# Altium schematic sheet POWER_RAIL_MONITORING.SchDoc
size B
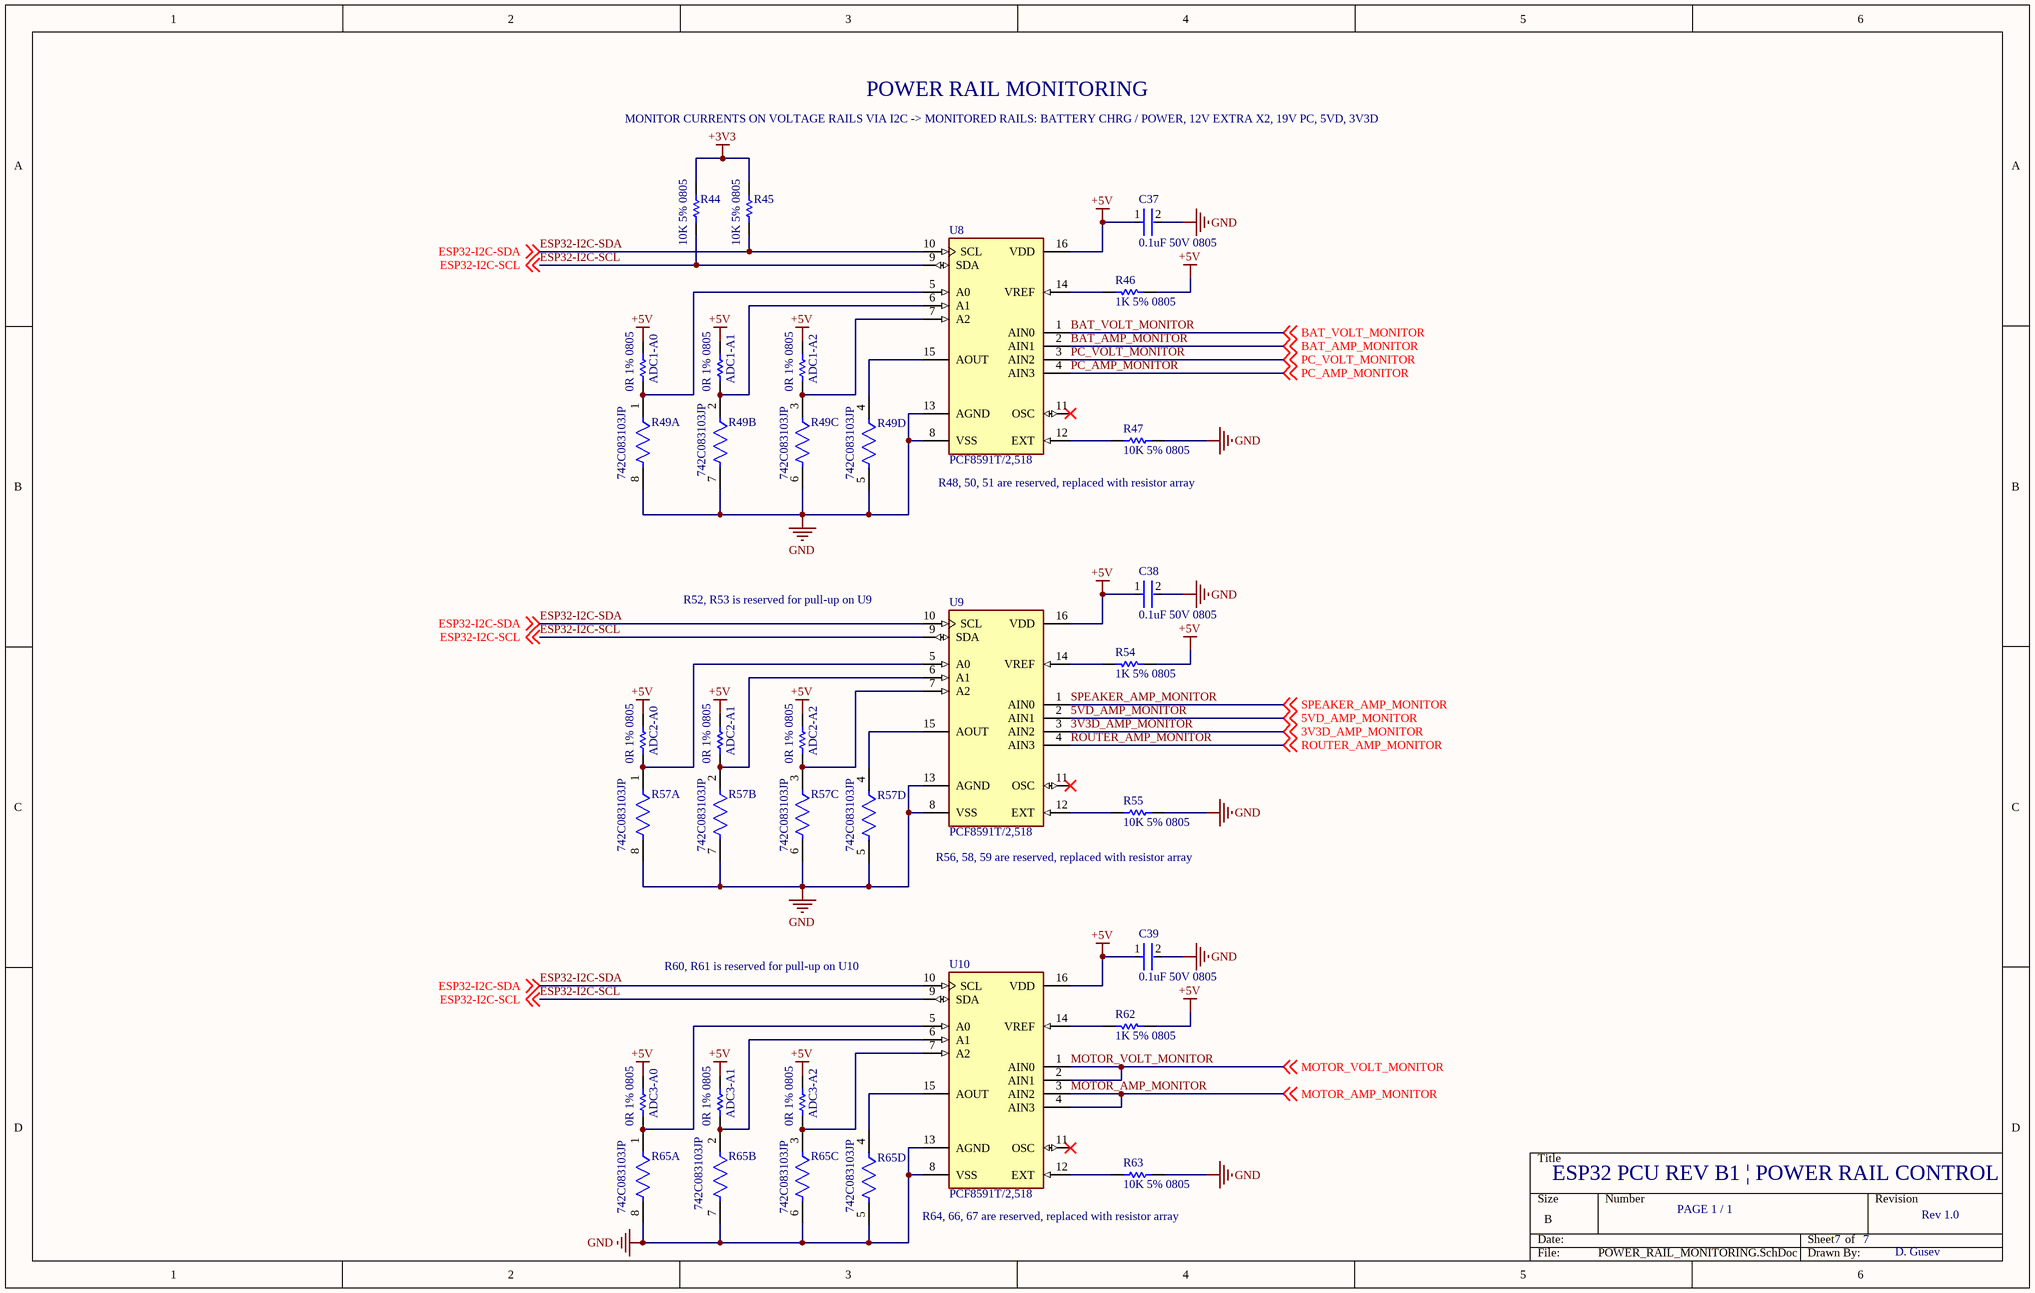
[diagram p0: POWER_RAIL_MONITORING.SchDoc]

## Parts
ADC1-A0  0R 1% 0805  [RESC2013X60X35LL10T20]
ADC1-A1  0R 1% 0805  [RESC2013X60X35LL10T20]
ADC1-A2  0R 1% 0805  [RESC2013X60X35LL10T20]
ADC2-A0  0R 1% 0805  [RESC2013X60X35LL10T20]
ADC2-A1  0R 1% 0805  [RESC2013X60X35LL10T20]
ADC2-A2  0R 1% 0805  [RESC2013X60X35LL10T20]
ADC3-A0  0R 1% 0805  [RESC2013X60X35LL10T20]
ADC3-A1  0R 1% 0805  [RESC2013X60X35LL10T20]
ADC3-A2  0R 1% 0805  [RESC2013X60X35LL10T20]
C37  0.1uF 50V 0805  [FP-C0805C-DN-MFG]
C38  0.1uF 50V 0805  [FP-C0805C-DN-MFG]
C39  0.1uF 50V 0805  [FP-C0805C-DN-MFG]
R44  10K 5% 0805  [RESC2013X60X40ML20T25]
R45  10K 5% 0805  [RESC2013X60X40ML20T25]
R46  1K 5% 0805  [RESC2013X60X40ML20T25]
R47  10K 5% 0805  [RESC2013X60X40ML20T25]
R49  742C083103JP  [FP-742C083-MFG]  (parts A,B,C,D of 4)
R54  1K 5% 0805  [RESC2013X60X40ML20T25]
R55  10K 5% 0805  [RESC2013X60X40ML20T25]
R57  742C083103JP  [FP-742C083-MFG]  (parts A,B,C,D of 4)
R62  1K 5% 0805  [RESC2013X60X40ML20T25]
R63  10K 5% 0805  [RESC2013X60X40ML20T25]
R65  742C083103JP  [FP-742C083-MFG]  (parts A,B,C,D of 4)
U8  PCF8591T/2,518  [FP-SOT162-1-MFG]
U9  PCF8591T/2,518  [FP-SOT162-1-MFG]
U10  PCF8591T/2,518  [FP-SOT162-1-MFG]

## Nets
+3V3: R44.2 R45.2
+5V: ADC1-A0.1 ADC1-A1.1 ADC1-A2.1 ADC2-A0.1 ADC2-A1.1 ADC2-A2.1 ADC3-A0.1 ADC3-A1.1 ADC3-A2.1 C37.1 C38.1 C39.1 R46.2 R54.2 R62.2 U8.16(VDD) U9.16(VDD) U10.16(VDD)
GND: C37.2 C38.2 C39.2 R47.2 R49.5 R49.6 R49.7 R49.8 R55.2 R57.5 R57.6 R57.7 R57.8 R63.2 R65.5 R65.6 R65.7 R65.8 U8.8(VSS) U8.13(AGND) U9.8(VSS) U9.13(AGND) U10.8(VSS) U10.13(AGND)
3V3D_AMP_MONITOR: U9.3(AIN2) ; off-sheet 3V3D_AMP_MONITOR
5VD_AMP_MONITOR: U9.2(AIN1) ; off-sheet 5VD_AMP_MONITOR
BAT_AMP_MONITOR: U8.2(AIN1) ; off-sheet BAT_AMP_MONITOR
BAT_VOLT_MONITOR: U8.1(AIN0) ; off-sheet BAT_VOLT_MONITOR
ESP32-I2C-SCL: R44.1 U8.9(SDA) U9.9(SDA) U10.9(SDA) ; off-sheet ESP32-I2C-SCL
ESP32-I2C-SDA: R45.1 U8.10(SCL) U9.10(SCL) U10.10(SCL) ; off-sheet ESP32-I2C-SDA
MOTOR_AMP_MONITOR: U10.3(AIN2) U10.4(AIN3) ; off-sheet MOTOR_AMP_MONITOR
MOTOR_VOLT_MONITOR: U10.1(AIN0) U10.2(AIN1) ; off-sheet MOTOR_VOLT_MONITOR
PC_AMP_MONITOR: U8.4(AIN3) ; off-sheet PC_AMP_MONITOR
PC_VOLT_MONITOR: U8.3(AIN2) ; off-sheet PC_VOLT_MONITOR
ROUTER_AMP_MONITOR: U9.4(AIN3) ; off-sheet ROUTER_AMP_MONITOR
SPEAKER_AMP_MONITOR: U9.1(AIN0) ; off-sheet SPEAKER_AMP_MONITOR
NetADC1-A0_2: ADC1-A0.2 R49.1 U8.5(A0)
NetADC1-A1_2: ADC1-A1.2 R49.2 U8.6(A1)
NetADC1-A2_2: ADC1-A2.2 R49.3 U8.7(A2)
NetADC2-A0_2: ADC2-A0.2 R57.1 U9.5(A0)
NetADC2-A1_2: ADC2-A1.2 R57.2 U9.6(A1)
NetADC2-A2_2: ADC2-A2.2 R57.3 U9.7(A2)
NetADC3-A0_2: ADC3-A0.2 R65.1 U10.5(A0)
NetADC3-A1_2: ADC3-A1.2 R65.2 U10.6(A1)
NetADC3-A2_2: ADC3-A2.2 R65.3 U10.7(A2)
NetR46_1: R46.1 U8.14(VREF)
NetR47_1: R47.1 U8.12(EXT)
NetR49_4: R49.4 U8.15(AOUT)
NetR54_1: R54.1 U9.14(VREF)
NetR55_1: R55.1 U9.12(EXT)
NetR57_4: R57.4 U9.15(AOUT)
NetR62_1: R62.1 U10.14(VREF)
NetR63_1: R63.1 U10.12(EXT)
NetR65_4: R65.4 U10.15(AOUT)

Not connected (* = marked no-connect by the designer): U8 11(OSC)*; U9 11(OSC)*; U10 11(OSC)*

## Notes on the sheet
- POWER RAIL MONITORING
- MONITOR CURRENTS ON VOLTAGE RAILS VIA I2C -> MONITORED RAILS: BATTERY CHRG / POWER, 12V EXTRA X2, 19V PC, 5VD, 3V3D
- R48, 50, 51 are reserved, replaced with resistor array
- (near U9) R52, R53 is reserved for pull-up on U9
- R56, 58, 59 are reserved, replaced with resistor array
- (near U10) R60, R61 is reserved for pull-up on U10
- R64, 66, 67 are reserved, replaced with resistor array
- ESP32 PCU REV B1 | POWER RAIL CONTROL
- PAGE 1 / 1
- 7
- Rev 1.0
- D. Gusev

## Library data of the parts
ADC1-A0-ADC1-A2 ADC2-A0-ADC2-A2 ADC3-A0-ADC3-A2 = CMP-1659-00014-4: Chip Resistor, 1 Ohm, +/- 1%, 125 mW, -55 to 155 degC, 0805 (2012 Metric), RoHS, Tape and Reel; Manufacturer: Yageo; Voltage Rating: 150 V; REACH SVHC: No SVHC; Mounting Technology: Surface Mount; RoHSCompliant: true; Packaging: Tape and Reel; ComponentLink2URL: http://www.yageo.com/documents/recent/PYu-RC_Group_51_RoHS_L_04.pdf; Pins: 2; Package Quantity: 5000; DatasheetVersion: Rev. 4, 02/2016; Mount: Surface Mount; Max Operating Temperature: 155 degC; PackageDescription: 2-Pin Surface Mounted Device, Body 2 x 1.25 mm; PackageReference: 0805; Length: 2 mm; Min Operating Temperature: -55 degC; ComponentLink1URL: http://www.yageo.com/; Height: 0.5 mm; ComponentLink1Description: Manufacturer URL; ComponentLink2Description: Datasheet
C37-C39 = CMP-2007-00279-2: CAP CER 0.1UF 50V X7R 0805; Manufacturer Part Number: C0805C104K5RACTU; Manufacturer: KEMET; Value: 0.10 μF; Tolerance: 0.1; Temperature Coefficient: 30ppm/°C; Material: Ceramic; Device Class L2: Capacitors; Temperature Range Low: -55°C; Voltage Rating: 50 V; Digikey Description: CAP CER 0.1UF 50V X7R 0805; Category: Cap; ComponentLink2Description: Datasheet; Octopart: https://octopart.com/c0805c104k5ractu-kemet-143926; RoHS: TRUE; ComponentLink2URL: https://content.kemet.com/datasheets/KEM_C1003_C0G_SMD.pdf; Temperature Characteristic: X7R; Temperature: -55°C to +125°C; Height: 0.88mm; Temperature Range High: +125°C; Device Class L1: Passive Components; Automotive: No; Lead Free: Yes; Ipc Land Pattern Name: CAPC200125X78; Device Class L3: Ceramic Capacitors; Mouser Description: Cap Ceramic 0.1uF 50V X7R 10% SMD 2.0 x 1.2 mm 125 C Paper T/R; Capacitance: 0.10 μF; Package: C0805C-DN
R44-R47 R54 R55 R62 R63 = CMP-2001-00590-1: Part Number: ERA6AEB123V; Manufacturer: Panasonic
R49 R57 R65 = CMP-06828-000005-1: RES ARRAY 4 RES 10K OHM 1206; Number of Elements: 4; Circuit Type: Isolated; Power Rating: 250mW; Working Voltage: 50V; Temperature Coefficient: 200ppm/°C; Tolerance: 5%; Resistance: 10kR; Power Per Element: 62.5mW; Power Dissipation: 63mW; Min Operating Temperature: -55°C; Height: 0.028inch; Number of Terminals: 8; Width: 0.063inch; Depth: 1.6mm; Max Operating Temperature: 125°C; Termination: Concave; Lead Free: Lead Free; Mount: Surface Mount; Package Quantity: 1; Military Standard: Not; Radiation Hardening: No; Contact Plating: Tin; Case Code (Metric): 3216; Terminal Pitch: 0.8mm; Number of Pins: 8; Case/Package: 0603; Case Code (Imperial): 1206; Length: 3.2mm; Packaging: Tape and Reel; Number of Resistors: 4
U8-U10 = CMP-10085-000001-1: IC ADC/DAC 8BIT 11.1K 16SO; Manufacturer: NXP Semiconductors; Standoff Height: 0.1mm; Interface: I2C; Nominal Supply Current: 125-450uA; Max Supply Voltage: 6V; Min Supply Voltage: 2.5V; Octopart: https://octopart.com/pcf8591t%2F2%2C518-nxp+semiconductors-7871876; Lead Free: Yes; Mouser Description: PCF8591 Series 2.5 V - 6 V 8-bit A/D and D/A converter - SOIC-16; Package: SOT162-1; Automotive: No; Temperature Range High: +85°C; Ambient Temperature Range High: +85°C; Ambient Temperature Range Low: -40°C; Temperature Range Low: -40°C; Temperature: -40°C to +85°C; Manufacturer Part Number: PCF8591T/2,518; Device Class L2: Data Converter ICs; Device Class L1: Integrated Circuits (ICs); Height: 2.65mm; ComponentLink2URL: https://www.nxp.com/docs/en/data-sheet/PCF8591.pdf; Digikey Description: IC ADC/DAC 8BIT 11.1K 16SO; Ipc Land Pattern Name: SOIC127P1032X265-16; Device Class L3: unset; Footprint Url: https://www.nxp.com/docs/en/package-information/SOT162-1.pdf; RoHS: TRUE; Category: IC; ComponentLink2Description: Datasheet